# Altium schematic sheet GSM UnUsed.SchDoc: GSM UnUsed Segment
size 292 x 193 mm; SheetNumber: 37; SheetTotal: 40
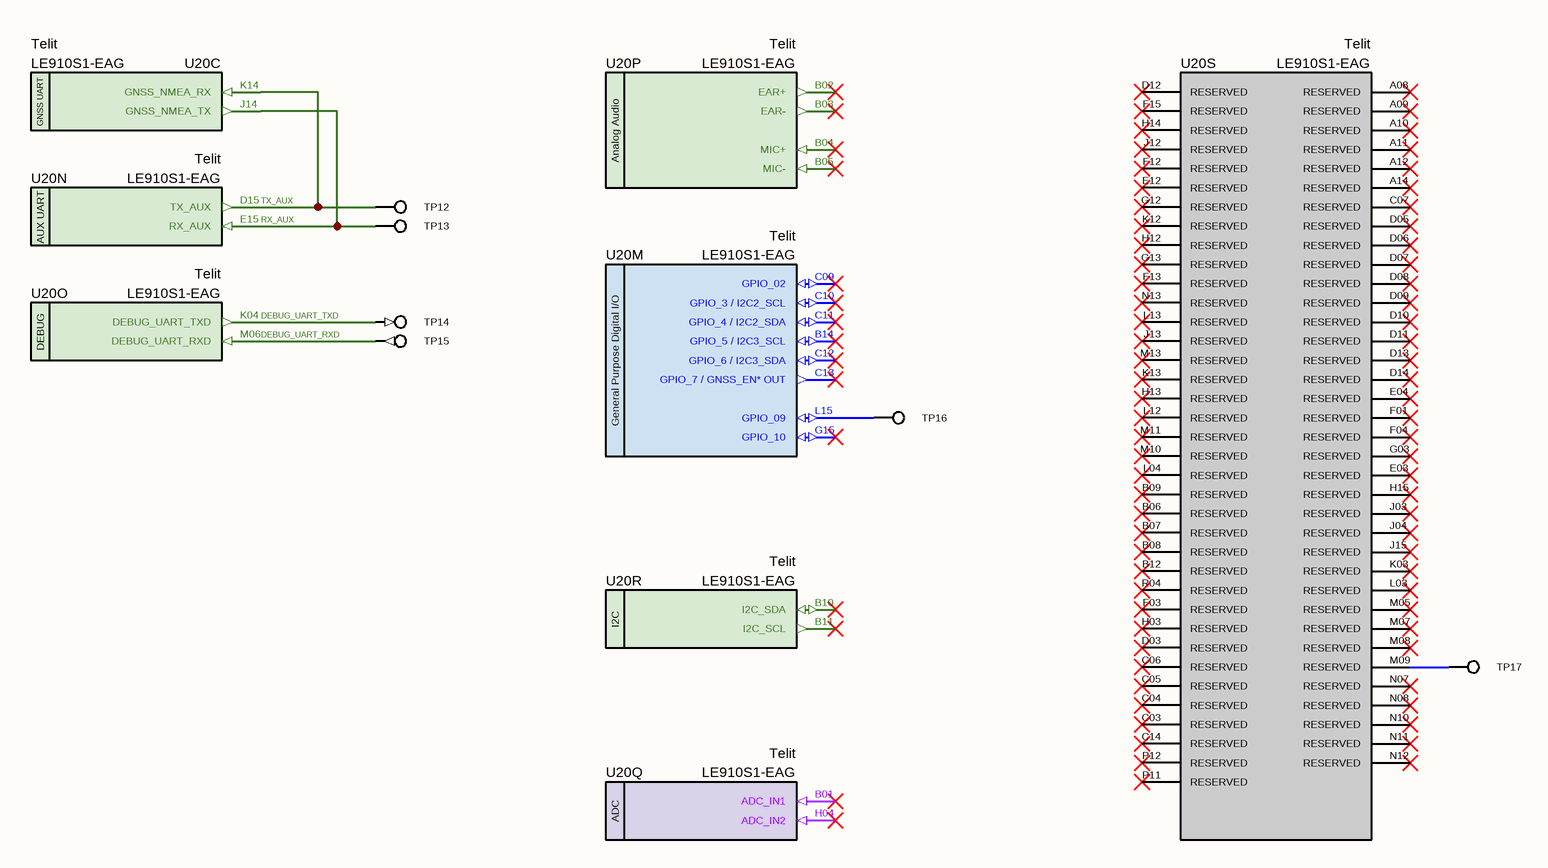
[diagram p0: GSM UnUsed.SchDoc]

## Parts
TP12  TP - GSM_Power_EN  [TP]  (value not drawn)  (no BOM)
TP13  TP - GSM_Power_EN  [TP]  (value not drawn)  (no BOM)
TP14  TP - GSM_Power_EN  [TP]  (value not drawn)  (no BOM)
TP15  TP - GSM_Power_EN  [TP]  (value not drawn)  (no BOM)
TP16  TP - GSM_Power_EN  [TP]  (value not drawn)  (no BOM)
TP17  TP - GSM_Power_EN  [TP]  (value not drawn)  (no BOM)
U20  Manufacturer Part Number: LE910S1-EAG  Manufacturer Name: Telit  [LE910 GSM Modem]  (hidden comment: LE910S1-EAG LTE GSM Module)  (parts C,M,N,O,P,Q,R,S of 19)

## Nets
DEBUG_UART_RXD: TP15.1 U20.M06(DEBUG_UART_RXD)
DEBUG_UART_TXD: TP14.1 U20.K04(DEBUG_UART_TXD)
RX_AUX: TP13.1 U20.E15(RX_AUX) U20.J14(GNSS_NMEA_TX)
TX_AUX: TP12.1 U20.D15(TX_AUX) U20.K14(GNSS_NMEA_RX)
NetTP16_1: TP16.1 U20.L15(GPIO_09)
NetTP17_1: TP17.1 U20.M09(RESERVED)

Not connected (* = marked no-connect by the designer): U20 A08(RESERVED)* A09(RESERVED)* A10(RESERVED)* A11(RESERVED)* A12(RESERVED)* A14(RESERVED)* B01(ADC_IN1)* B02(EAR+)* B03(EAR-)* B04(MIC+)* B05(MIC-)* B06(RESERVED)* B07(RESERVED)* B08(RESERVED)* B09(RESERVED)* B10(I2C_SDA)* B11(I2C_SCL)* B12(RESERVED)* B14(GPIO_5_/_I2C3_SCL)* C03(RESERVED)* C04(RESERVED)* C05(RESERVED)* C06(RESERVED)* C07(RESERVED)* C09(GPIO_02)* C10(GPIO_3_/_I2C2_SCL)* C11(GPIO_4_/_I2C2_SDA)* C12(GPIO_6_/_I2C3_SDA)* C13(GPIO_7_/_GNSS_EN*_OUT)* C14(RESERVED)* D03(RESERVED)* D05(RESERVED)* D06(RESERVED)* D07(RESERVED)* D08(RESERVED)* D09(RESERVED)* D10(RESERVED)* D11(RESERVED)* D12(RESERVED)* D13(RESERVED)* D14(RESERVED)* E03(RESERVED)* E04(RESERVED)* E12(RESERVED)* F01(RESERVED)* F03(RESERVED)* F04(RESERVED)* F12(RESERVED)* F13(RESERVED)* F15(RESERVED)* G03(RESERVED)* G12(RESERVED)* G13(RESERVED)* G15(GPIO_10)* H03(RESERVED)* H04(ADC_IN2)* H12(RESERVED)* H13(RESERVED)* H14(RESERVED)* H15(RESERVED)* J03(RESERVED)* J04(RESERVED)* J12(RESERVED)* J13(RESERVED)* J15(RESERVED)* K03(RESERVED)* K12(RESERVED)* K13(RESERVED)* L03(RESERVED)* L04(RESERVED)* L12(RESERVED)* L13(RESERVED)* M05(RESERVED)* M07(RESERVED)* M08(RESERVED)* M10(RESERVED)* M11(RESERVED)* M13(RESERVED)* N07(RESERVED)* N08(RESERVED)* N10(RESERVED)* N11(RESERVED)* N12(RESERVED)* N13(RESERVED)* P11(RESERVED)* P12(RESERVED)* R04(RESERVED)*

## Notes on the sheet
- © 2021 All rights reserved.
  This document may not, in whole or in part, be copied, photocopied, reproduced, translated or converted to any electronic or machine readable from without prior written permission of Mehmet Günce Akkoyun.
  Engineer contact : akkoyun@me.com
- Property of
- Engineer :
- Date :
- Size :
- A4
- Time :
- Project :
- Page :
- /
- Customer :
- Product ID :
- Module ID :
- Version :
- File :
- Revision :
- (in symbol IC - LE910S1-EAG, part C) GNSS UART
- (in symbol IC - LE910S1-EAG, part M) General Purpose Digital I/O
- (in symbol IC - LE910S1-EAG, part N) AUX UART
- (in symbol IC - LE910S1-EAG, part O) DEBUG
- (in symbol IC - LE910S1-EAG, part P) Analog Audio
- (in symbol IC - LE910S1-EAG, part Q) ADC
- (in symbol IC - LE910S1-EAG, part R) I2C

## Library data of the parts
TP12-TP17 = PCB - Test Point: Test Point
U20 = IC - LE910S1-EAG: Telit LE910S1-EAG GPRS/GNSS Module; Case: BGA